# Altium schematic sheet RPL_POWER_SOLENOIDS.SchDoc
size A
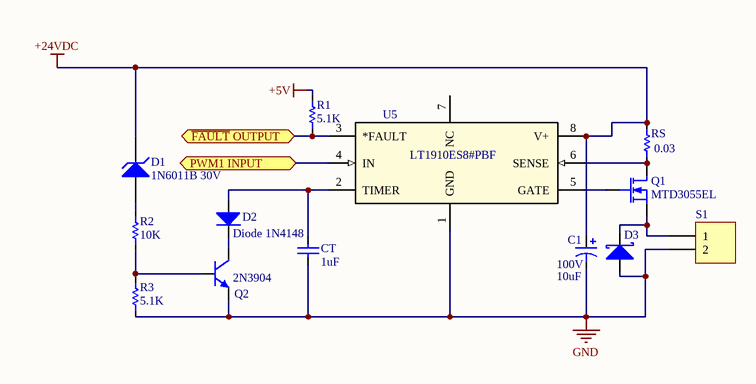
[diagram p0: RPL_POWER_SOLENOIDS.SchDoc]

## Parts
C1  100V  value 10uF  [RADIAL]
CT  value 1uF  [C0402T104K4RACTU]  (hidden comment: Cap)
D1  1N6011B 30V  [DIODE-0.7]
D2  Diode 1N4148  [DO-35]
D3  Diod  [SOD323_F]  (value not drawn)
Q1  MTD3055EL  [TO229P990X239-3N]
Q2  2N3904  [TO-92A]
R1  value 5.1K  [0603]  (hidden comment: Res)
R2  value 10K  [0603]  (hidden comment: Res)
R3  value 5.1K  [0603]  (hidden comment: Res)
RS  value 0.03  [0603]  (hidden comment: Res)
S1  Header 2  [HDR1X2]  (value not drawn)
U5  LT1910ES8#PBF  [SO-8_S]

## Ports
PWM1 INPUT, ~{FAULT} OUTPUT

## Nets
+5V: R1.2
+24VDC: C1.1 D1.2(K) RS.2 U5.8(V+)
GND: C1.2 CT.1 D3.1(A) Q2.1(E) R3.1 S1.2 U5.1(GND)
~{FAULT} OUTPUT: R1.1 U5.3(*FAULT) ; port ~{FAULT} OUTPUT
PWM1 INPUT: U5.4(IN) ; port PWM1 INPUT
NetCT_2: CT.2 D2.1(A) U5.2(TIMER)
NetD1_1: D1.1(A) R2.2
NetD2_2: D2.2(K) Q2.3(C)
NetD3_3: D3.3(K) Q1.3(S) S1.1
NetQ1_1: Q1.1(D) RS.1 U5.6(SENSE)
NetQ1_2: Q1.2(G) U5.5(GATE)
NetQ2_2: Q2.2(B) R2.1 R3.2

Not connected (* = marked no-connect by the designer): U5 7(NC)

## Library data of the parts
C1 = Cap Elec
D1 = D Zener: Zener Diode; Published: 8-Jun-2000; LatestRevisionDate: 17-Jul-2002; LatestRevisionNote: Re-released for DXP Platform.; PackageReference: DIODE-0.7; Publisher: Altium Limited; PackageDescription: Diode, Thru-Hole; 2 Leads; 0.7 in Pin Spacing
D2 = Diode 1N4148: High Conductance Fast Diode; Published: 8-Jun-2000; LatestRevisionDate: 17-Jul-2002; LatestRevisionNote: Re-released for DXP Platform.; DatasheetVersion: 1997; PackageReference: DO-35; Publisher: Altium Limited; PackageDescription: Diode, Axial; Body 3.8 x 1.9 mm (LxDia. max), Lead Dia. 0.53 mm (max); Code_JEDEC: DO-204-AH; ComponentLink1Description: Manufacturer Link; ComponentLink1URL: http://www.fairchildsemi.com/; ComponentLink2Description: Datasheet; ComponentLink2URL: http://www.fairchildsemi.com/ds/1N%2F1N4148.pdf
Q1 = Mosfet
Q2 = 2N3904: NPN General Purpose Amplifier; Published: 8-Jun-2000; LatestRevisionDate: 15-Jan-2003; LatestRevisionNote: PCB Footprint 'BCY-W3/D4.7' replaced; DatasheetVersion: 1997; PackageVersion: Sep-1998; PackageReference: TO-92A; Publisher: Altium Limited; PackageDescription: TO, Flat Index; 3 In-Line, Axial Leads; Body Dia. 4.5mm; Leads 0.51 x 0.48 mm (max); ComponentLink1Description: Manufacturer Link; ComponentLink1URL: http://www.fairchildsemi.com/; ComponentLink2Description: Datasheet; ComponentLink2URL: http://www.fairchildsemi.com/ds/2N%2F2N3904.pdf
S1 = Header 2: Header, 2-Pin; LatestRevisionDate: 17-Jul-2002; LatestRevisionNote: Re-released for DXP Platform.; Publisher: Altium Limited
U5 = LT1910ES8#PBF: Imported; Vendor: Linear Technology; Manufacturer_Part_Number: lt1910es8#pbf; Value: Value; Type: Type; RefDes: RefDes